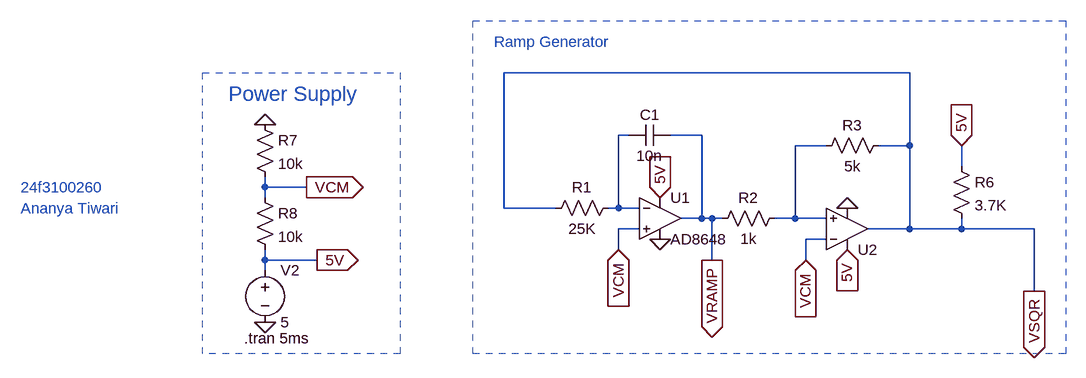
[diagram p0: schematic Analog1.asc]
Analog1.asc, the LTspice schematic file:
Version 4.1
SHEET 1 1384 680
WIRE 1120 32 496 32
WIRE 688 128 672 128
WIRE 800 128 752 128
WIRE 992 144 944 144
WIRE 1120 144 1120 32
WIRE 1120 144 1072 144
WIRE 1200 176 1200 144
WIRE 128 208 128 192
WIRE 192 208 128 208
WIRE 128 224 128 208
WIRE 496 240 496 32
WIRE 576 240 496 240
WIRE 672 240 672 128
WIRE 672 240 656 240
WIRE 704 240 672 240
WIRE 800 256 800 128
WIRE 800 256 768 256
WIRE 816 256 800 256
WIRE 832 256 816 256
WIRE 944 256 944 144
WIRE 944 256 912 256
WIRE 992 256 944 256
WIRE 704 272 672 272
WIRE 1120 272 1120 144
WIRE 1120 272 1056 272
WIRE 1200 272 1200 256
WIRE 1200 272 1120 272
WIRE 1312 272 1200 272
WIRE 992 288 960 288
WIRE 672 304 672 272
WIRE 128 320 128 304
WIRE 208 320 128 320
WIRE 816 320 816 256
WIRE 960 320 960 288
WIRE 128 336 128 320
WIRE 1312 368 1312 272
FLAG 672 304 VCM
IOPIN 672 304 In
FLAG 1200 144 5V
IOPIN 1200 144 In
FLAG 1312 368 VSQR
IOPIN 1312 368 Out
FLAG 816 320 VRAMP
IOPIN 816 320 Out
FLAG 736 288 0
FLAG 736 224 5V
IOPIN 736 224 In
FLAG 960 320 VCM
IOPIN 960 320 In
FLAG 1024 304 5V
IOPIN 1024 304 In
FLAG 1024 240 0
FLAG 128 416 0
FLAG 128 112 0
FLAG 192 208 VCM
IOPIN 192 208 Out
FLAG 208 320 5V
IOPIN 208 320 Out
SYMBOL OpAmps\\AD8648 736 192 R0
SYMATTR InstName U1
SYMBOL OpAmps\\UniversalOpAmp2 1024 272 M180
SYMATTR InstName U2
SYMBOL res 928 240 R90
WINDOW 0 0 56 VBottom 2
WINDOW 3 32 56 VTop 2
SYMATTR InstName R2
SYMATTR Value 1k
SYMATTR SpiceLine tol=1 pwr=0
SYMBOL res 672 224 R90
WINDOW 0 0 56 VBottom 2
WINDOW 3 32 56 VTop 2
SYMATTR InstName R1
SYMATTR Value 25K
SYMBOL res 1088 128 R90
WINDOW 0 0 56 VBottom 2
WINDOW 3 32 56 VTop 2
SYMATTR InstName R3
SYMATTR Value 5k
SYMBOL cap 752 112 R90
WINDOW 0 0 32 VBottom 2
WINDOW 3 32 32 VTop 2
SYMATTR InstName C1
SYMATTR Value 10n
SYMBOL res 1184 160 R0
SYMATTR InstName R6
SYMATTR Value 3.7K
SYMBOL res 112 96 R0
SYMATTR InstName R7
SYMATTR Value 10k
SYMATTR SpiceLine tol=1 pwr=0.1
SYMBOL res 112 208 R0
SYMATTR InstName R8
SYMATTR Value 10k
SYMBOL voltage 128 320 R0
WINDOW 123 0 0 Left 0
WINDOW 39 0 0 Left 0
SYMATTR InstName V2
SYMATTR Value 5
TEXT 480 -16 Left 2 ;Ramp Generator
TEXT 96 440 Left 2 !.tran 5ms
TEXT 72 64 Left 3 ;Power Supply
TEXT -248 208 Left 2 ;24f3100260
TEXT -248 240 Left 2 ;Ananya Tiwari
RECTANGLE Normal 1360 464 448 -48 2
RECTANGLE Normal 336 464 32 32 2

The netlist it stands for:
* Analog1.asc
X§U1 VCM N001 5V 0 VRAMP AD8648  ; pins In+ In- V+ V- OUT
X§U2 N002 VCM 5V 0 VSQR level2 Avol=1Meg GBW=10Meg Slew=10Meg Ilimit=25m Rail=0 Vos=0 En=0 Enk=0 In=0 Ink=0 Rin=500Meg  ; pins In+ In- V+ V- OUT
R2 N002 VRAMP 1k tol=1 pwr=0
R1 N001 VSQR 25K
R3 VSQR N002 5k
C1 VRAMP N001 10n
R6 5V VSQR 3.7K
R7 0 VCM 10k tol=1 pwr=0.1
R8 VCM 5V 10k
V2 5V 0 5
* Ramp Generator
.tran 5ms
* Power Supply
* 24f3100260
* Ananya Tiwari
.lib ADI.lib
.lib UniversalOpAmp2.lib
.backanno
.end